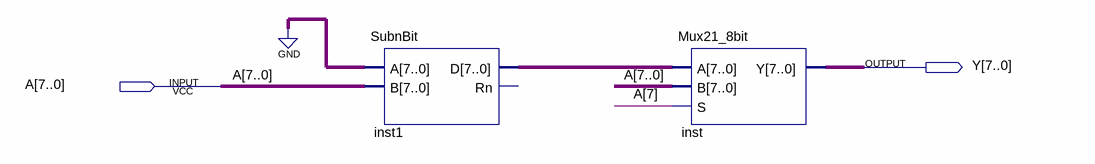
[diagram p0: schematic sheet]
// Quartus schematic TriTuyetDoi.bdf as structural Verilog: 2 symbols, 2 pins
module TriTuyetDoi (
  input  [7:0] A,
  output [7:0] Y
);

  wire [7:0] inst1_d;

  SubnBit inst1 (.A({8{1'b0}}), .B(A), .D(inst1_d));  // open: Rn
  Mux21_8bit inst (.A(inst1_d), .B(A), .S(A[7]), .Y(Y));
endmodule
